# Altium schematic sheet praxis_top_level_shcdoc.SchDoc
size 393 x 281 mm; Organization: Altium Limited; Address1: L3, 12a Rodborough Rd; Address2: Frenchs Forest; Address3: NSW; Address4: Australia 2086
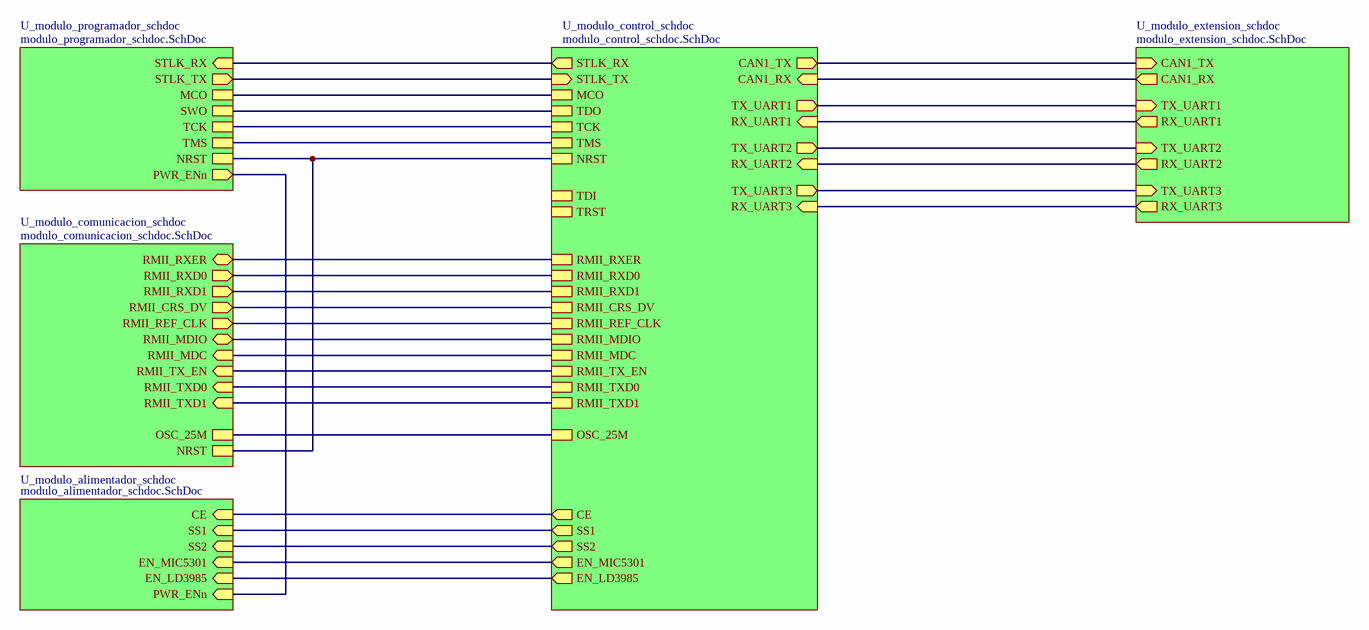
[diagram p0: praxis_top_level_shcdoc.SchDoc]

## Sub-sheets
U_modulo_alimentador_schdoc = modulo_alimentador_schdoc.SchDoc: SS1 (in), SS2 (in), PWR_ENn (in), CE (in), EN_MIC5301 (in), EN_LD3985 (in)
U_modulo_comunicacion_schdoc = modulo_comunicacion_schdoc.SchDoc: RMII_TXD0 (in), RMII_TX_EN (in), RMII_RXD0 (out), RMII_REF_CLK (out), RMII_CRS_DV (out), RMII_MDC (in), RMII_MDIO (bidir), NRST, RMII_TXD1 (in), RMII_RXD1 (out), RMII_RXER (bidir), OSC_25M
U_modulo_control_schdoc = modulo_control_schdoc.SchDoc: RMII_TXD0, RMII_TX_EN, RMII_RXD0, RMII_REF_CLK, RMII_CRS_DV, RMII_MDC, RMII_MDIO, RMII_TXD1, RMII_RXD1, RMII_RXER, OSC_25M, STLK_RX (out), STLK_TX (in), TDO, TCK, TMS, TDI, TRST, CE (out), EN_MIC5301 (out), EN_LD3985 (out), SS1 (out), SS2 (out), TX_UART1 (out), RX_UART1 (in), TX_UART2 (out), TX_UART3 (out), RX_UART3 (in), CAN1_RX (in), CAN1_TX (out), MCO, NRST, RX_UART2 (in)
U_modulo_extension_schdoc = modulo_extension_schdoc.SchDoc: TX_UART1 (in), RX_UART1 (out), TX_UART2 (in), RX_UART2 (out), TX_UART3 (in), RX_UART3 (out), CAN1_TX (in), CAN1_RX (out)
U_modulo_programador_schdoc = modulo_programador_schdoc.SchDoc: STLK_TX (out), STLK_RX (in), MCO, PWR_ENn (out), TMS, TCK, NRST, SWO

## Nets
(unnamed): sheet U_modulo_alimentador_schdoc/SS1, sheet U_modulo_control_schdoc/SS1
(unnamed): sheet U_modulo_alimentador_schdoc/SS2, sheet U_modulo_control_schdoc/SS2
(unnamed): sheet U_modulo_alimentador_schdoc/PWR_ENn, sheet U_modulo_programador_schdoc/PWR_ENn
(unnamed): sheet U_modulo_alimentador_schdoc/CE, sheet U_modulo_control_schdoc/CE
(unnamed): sheet U_modulo_alimentador_schdoc/EN_MIC5301, sheet U_modulo_control_schdoc/EN_MIC5301
(unnamed): sheet U_modulo_alimentador_schdoc/EN_LD3985, sheet U_modulo_control_schdoc/EN_LD3985
(unnamed): sheet U_modulo_extension_schdoc/TX_UART1, sheet U_modulo_control_schdoc/TX_UART1
(unnamed): sheet U_modulo_extension_schdoc/RX_UART1, sheet U_modulo_control_schdoc/RX_UART1
(unnamed): sheet U_modulo_extension_schdoc/TX_UART2, sheet U_modulo_control_schdoc/TX_UART2
(unnamed): sheet U_modulo_extension_schdoc/RX_UART2, sheet U_modulo_control_schdoc/RX_UART2
(unnamed): sheet U_modulo_extension_schdoc/TX_UART3, sheet U_modulo_control_schdoc/TX_UART3
(unnamed): sheet U_modulo_extension_schdoc/RX_UART3, sheet U_modulo_control_schdoc/RX_UART3
(unnamed): sheet U_modulo_extension_schdoc/CAN1_TX, sheet U_modulo_control_schdoc/CAN1_TX
(unnamed): sheet U_modulo_extension_schdoc/CAN1_RX, sheet U_modulo_control_schdoc/CAN1_RX
(unnamed): sheet U_modulo_comunicacion_schdoc/RMII_TXD0, sheet U_modulo_control_schdoc/RMII_TXD0
(unnamed): sheet U_modulo_comunicacion_schdoc/RMII_TX_EN, sheet U_modulo_control_schdoc/RMII_TX_EN
(unnamed): sheet U_modulo_comunicacion_schdoc/RMII_RXD0, sheet U_modulo_control_schdoc/RMII_RXD0
(unnamed): sheet U_modulo_comunicacion_schdoc/RMII_REF_CLK, sheet U_modulo_control_schdoc/RMII_REF_CLK
(unnamed): sheet U_modulo_comunicacion_schdoc/RMII_CRS_DV, sheet U_modulo_control_schdoc/RMII_CRS_DV
(unnamed): sheet U_modulo_comunicacion_schdoc/RMII_MDC, sheet U_modulo_control_schdoc/RMII_MDC
(unnamed): sheet U_modulo_comunicacion_schdoc/RMII_MDIO, sheet U_modulo_control_schdoc/RMII_MDIO
(unnamed): sheet U_modulo_comunicacion_schdoc/NRST, sheet U_modulo_programador_schdoc/NRST, sheet U_modulo_control_schdoc/NRST
(unnamed): sheet U_modulo_comunicacion_schdoc/RMII_TXD1, sheet U_modulo_control_schdoc/RMII_TXD1
(unnamed): sheet U_modulo_comunicacion_schdoc/RMII_RXD1, sheet U_modulo_control_schdoc/RMII_RXD1
(unnamed): sheet U_modulo_comunicacion_schdoc/RMII_RXER, sheet U_modulo_control_schdoc/RMII_RXER
(unnamed): sheet U_modulo_comunicacion_schdoc/OSC_25M, sheet U_modulo_control_schdoc/OSC_25M
(unnamed): sheet U_modulo_programador_schdoc/STLK_TX, sheet U_modulo_control_schdoc/STLK_TX
(unnamed): sheet U_modulo_programador_schdoc/STLK_RX, sheet U_modulo_control_schdoc/STLK_RX
(unnamed): sheet U_modulo_programador_schdoc/MCO, sheet U_modulo_control_schdoc/MCO
(unnamed): sheet U_modulo_programador_schdoc/TMS, sheet U_modulo_control_schdoc/TMS
(unnamed): sheet U_modulo_programador_schdoc/TCK, sheet U_modulo_control_schdoc/TCK
(unnamed): sheet U_modulo_programador_schdoc/SWO, sheet U_modulo_control_schdoc/TDO

## Notes on the sheet
- Título:
- Autor:
- Tamaño:
- Número:
- Fecha:
- Revisión:
- Hoja:
- Hora:
- de
- Revisado por: